# EAGLE design V0p2_Main_PCB2 (EAGLE 6.4)
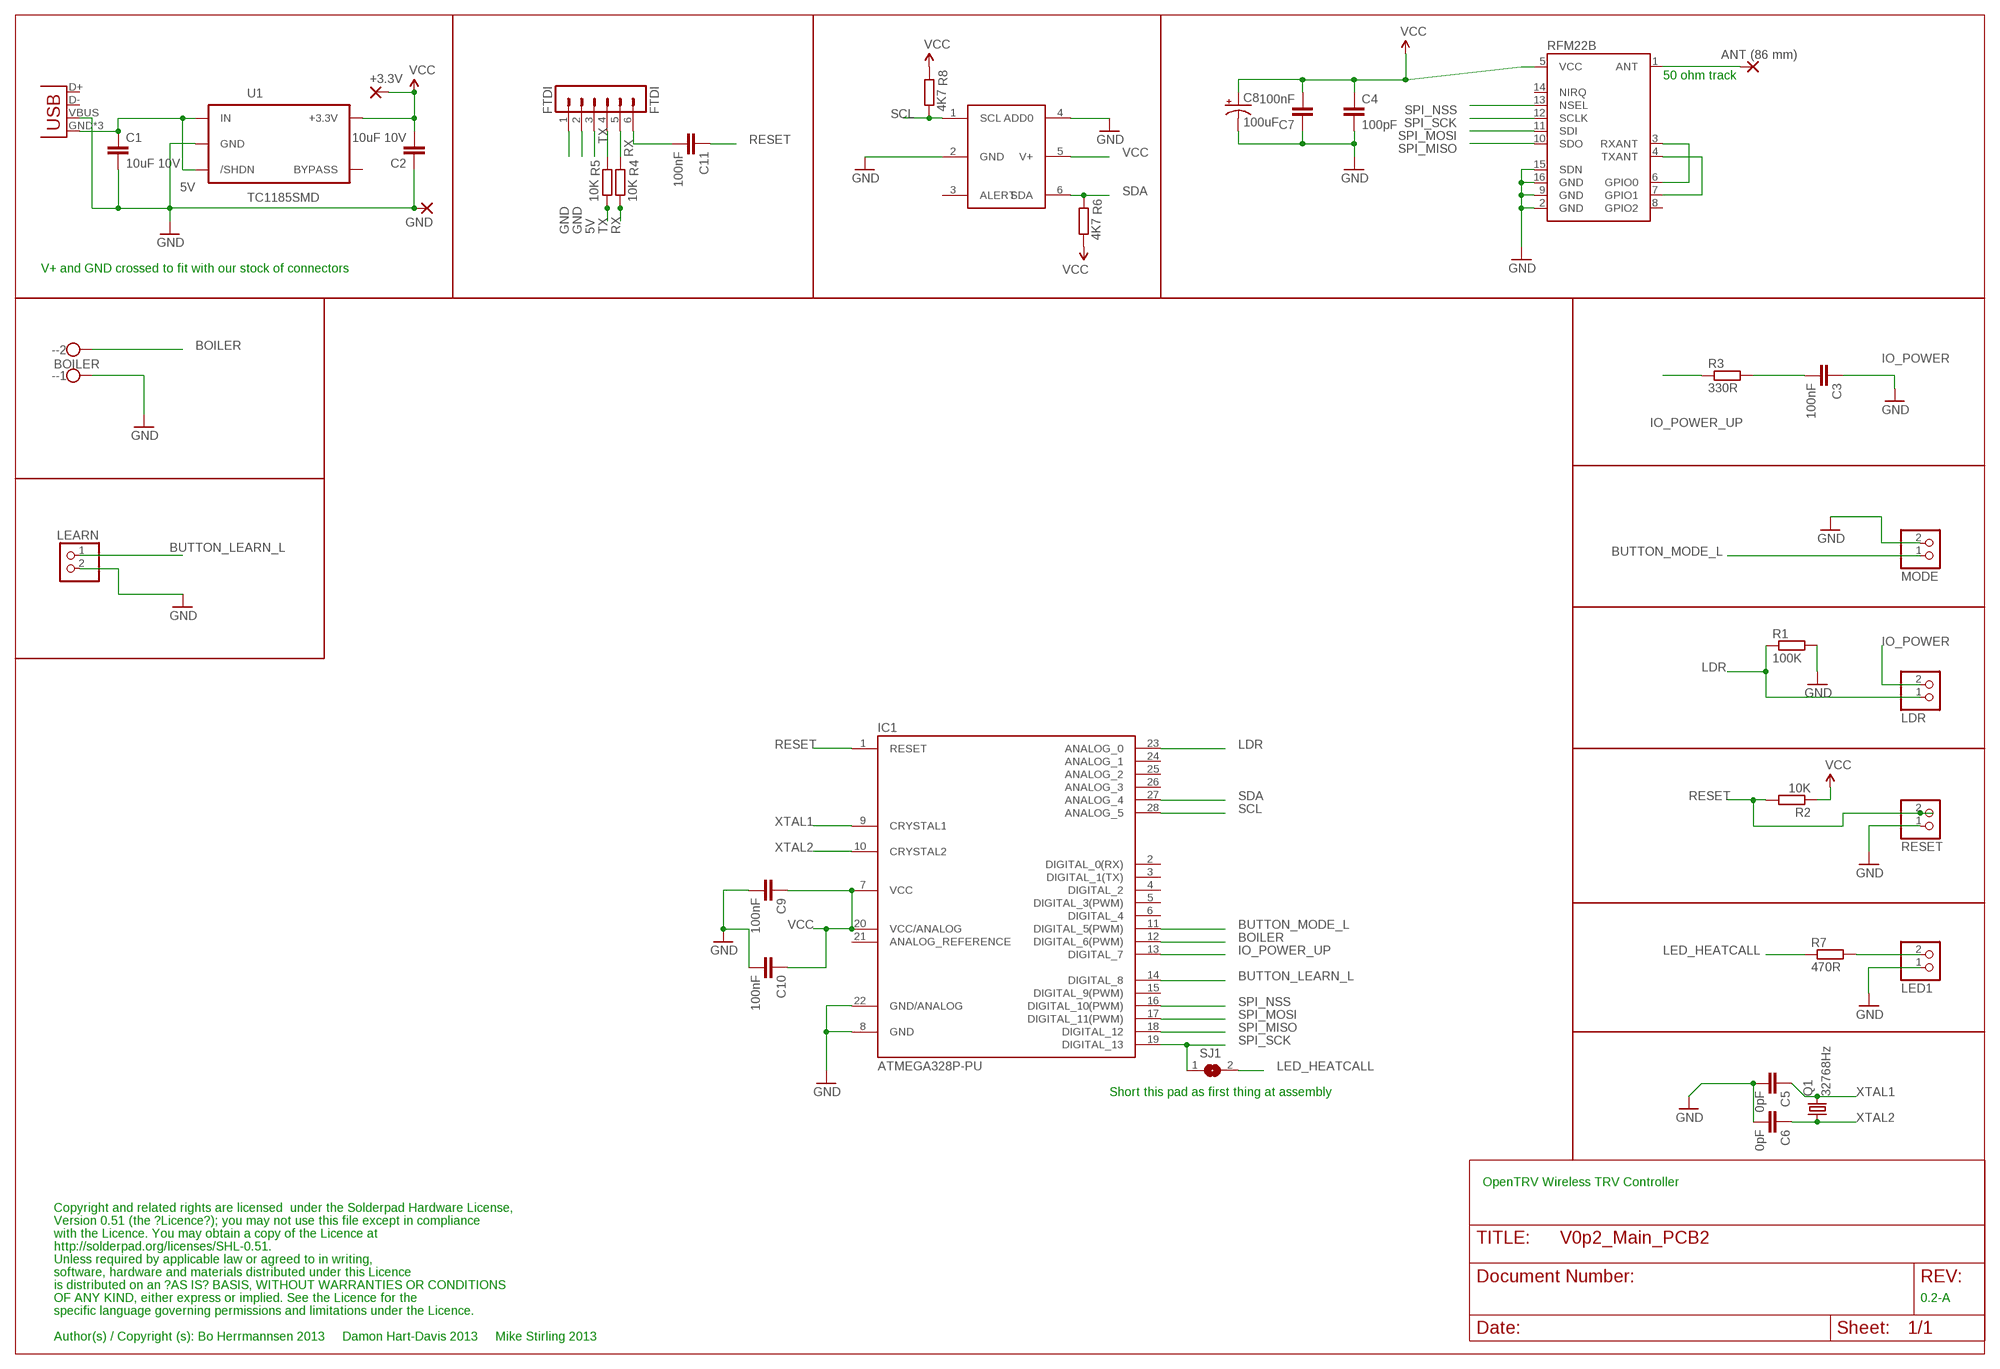
[diagram p0: schematic, sheet 1]

## Parts
5V  USB-MICROB  [USB-MICROB]
+3.3V  2,15/1,0  [2,15/1,0]
-  BOILER  W237-102  [W237-102]
ANT  ANT (86 mm)  2,15/1,0  [2,15/1,0]
C1  10uF 10V  CAP0603-CAP  [0603-CAP]
C2  10uF 10V  CAP0603-CAP  [0603-CAP]
C3  100nF  CAP0603-CAP  [0603-CAP]
C4  100pF  CAP0603-CAP  [0603-CAP]
C5  0pF  CAP0603-CAP  [0603-CAP]
C6  0pF  CAP0603-CAP  [0603-CAP]
C7  100nF  CAP0603-CAP  [0603-CAP]
C8  100uF  CAP_POL1206  [EIA3216]
C9  100nF  CAP0603-CAP  [0603-CAP]
C10  100nF  CAP0603-CAP  [0603-CAP]
C11  100nF  CAP0603-CAP  [0603-CAP]
FTDI  FTDI  MA06-1  [MA06-1]
GND  2,15/1,0  [2,15/1,0]
IC1  ATMEGA328P-PU  ATMEGA168-PU  [DIL28-3]
LDR  PINHD-1X2  [1X02]
LEARN  PINHD-1X2  [1X02]
LED1  PINHD-1X2  [1X02]
MODE  PINHD-1X2  [1X02]
Q1  32768Hz  CRYSTALHC49S  [HC49/S]
R1  100K  R-EU_R0603  [R0603]
R2  10K  R-EU_R0603  [R0603]
R3  330R  R-EU_R0603  [R0603]
R4  10K  R-EU_R0603  [R0603]
R5  10K  R-EU_R0603  [R0603]
R6  4K7  R-EU_R0603  [R0603]
R7  470R  R-EU_R0603  [R0603]
R8  4K7  R-EU_R0603  [R0603]
RESET  PINHD-1X2  [1X02]
RFM22B  RFM22SMD  [RFM22-XXX-S2]
SJ1  SJ  [SJ]
TMP112  TMP112  [TMP112]
U1  TC1185SMD  [TC1185]

## Nets
5V: 5V.GND 5V.MT1(GND) 5V.MT2(GND) C1.1 FTDI.3(VCC) U1.1(IN) U1.3(/SHDN)
BOILER: -.2 IC1.12(DIGITAL_6(PWM))
BUTTON_LEARN_L: IC1.14(DIGITAL_8) LEARN.1
BUTTON_MODE_L: IC1.11(DIGITAL_5(PWM)) MODE.1
GND: 5V.VBUS -.1 C1.2 C2.1 C4.2 C5.2 C6.2 C7.1 C8.C(-) C9.2 C10.2 FTDI.1(GND) FTDI.2(CTS) GND.1(P) IC1.8(GND) IC1.22(GND/ANALOG) LEARN.2 LED1.1 MODE.2 R1.2 RESET.1 RFM22B.2(GND) RFM22B.9(GND) RFM22B.15(SDN) RFM22B.16(GND) TMP112.2(GND) TMP112.4(ADD0) U1.2(GND)
IO_POWER: C3.1 LDR.2 ; supply symbol labelled GND
IO_POWER_UP: IC1.13(DIGITAL_7) R3.1
LDR: IC1.23(ANALOG_0) LDR.1 R1.1
LED_HEATCALL: R7.1 SJ1.2
LEDEXT: LED1.2 R7.2
N$1: C11.2 FTDI.6(RTS)
N$2: C3.2 R3.2
N$20: RFM22B.3(RXANT) RFM22B.6(GPIO0)
N$21: RFM22B.4(TXANT) RFM22B.7(GPIO1)
N$26: ANT.1(P) RFM22B.1(ANT)
RESET: C11.1 IC1.1(RESET) R2.2 RESET.2
RX: FTDI.5(RX) R4.1 R4.2
SCL: IC1.28(ANALOG_5) R8.1 TMP112.1(SCL)
SDA: IC1.27(ANALOG_4) R6.2 TMP112.6(SDA)
SPI_MISO: IC1.18(DIGITAL_12) RFM22B.10(SDO)
SPI_MOSI: IC1.17(DIGITAL_11(PWM)) RFM22B.11(SDI)
SPI_NSS: IC1.16(DIGITAL_10(PWM)) RFM22B.13(NSEL)
SPI_SCK: IC1.19(DIGITAL_13) RFM22B.12(SCLK) SJ1.1
TX: FTDI.4(TX) R5.1 R5.2
VCC: +3.3V.1(P) C2.2 C4.1 C7.2 C8.A(+) C9.1 C10.1 IC1.7(VCC) IC1.20(VCC/ANALOG) R2.1 R6.1 R8.2 RFM22B.5(VCC) TMP112.5(V+) U1.5(+3.3V)
XTAL1: C5.1 IC1.9(CRYSTAL1) Q1.2
XTAL2: C6.1 IC1.10(CRYSTAL2) Q1.1
Unconnected: 5V.D+ 5V.D- IC1.2(DIGITAL_0(RX)) IC1.3(DIGITAL_1(TX)) IC1.4(DIGITAL_2) IC1.5(DIGITAL_3(PWM)) IC1.6(DIGITAL_4) IC1.15(DIGITAL_9(PWM)) IC1.21(ANALOG_REFERENCE) IC1.24(ANALOG_1) IC1.25(ANALOG_2) IC1.26(ANALOG_3) RFM22B.8(GPIO2) RFM22B.14(NIRQ) TMP112.3(ALERT) U1.4(BYPASS)

## Notes on the sheet
- 50 ohm track
- V+ and GND crossed to fit with our stock of connectors
- Short this pad as first thing at assembly
- OpenTRV Wireless TRV Controller
- Copyright and related rights are licensed  under the Solderpad Hardware License,
- Version 0.51 (the ?Licence?); you may not use this file except in compliance
- with the Licence. You may obtain a copy of the Licence at
- http://solderpad.org/licenses/SHL-0.51.
- Unless required by applicable law or agreed to in writing,
- software, hardware and materials distributed under this Licence
- is distributed on an ?AS IS? BASIS, WITHOUT WARRANTIES OR CONDITIONS
- OF ANY KIND, either express or implied. See the Licence for the | 0.2-A
- specific language governing permissions and limitations under the Licence.
- Author(s) / Copyright (s): Bo Herrmannsen 2013     Damon Hart-Davis 2013     Mike Stirling 2013

## Library data of the parts
5V = SparkFun-Connectors:USB: USB Connectors USB-B-PTH is fully proven SKU : PRT-00139 USB-miniB is fully proven SKU : PRT-00587 USB-A-PCB is untested. USB-A-H is throughly reviewed, but untested. Spark Fun Electronics SKU : PRT-00437 USB-B-SMT is throughly reviewed, but untested. Needs silkscreen touching up. USB-A-S has not been used/tested USB-MB-H has not been used/tested
+3.3V ANT GND = wirepad:2,15/1,0: THROUGH-HOLE PAD
- = con-wago-500:W237-102: WAGO SCREW CLAMP; MPN: 237-102; OC_FARNELL: unknown; OC_NEWARK: 70K9898
C1-C7 C9-C11 = SparkFun-Passives:CAP: Capacitor Standard 0603 ceramic capacitor, and 0.1" leaded capacitor.
C8 = SparkFun-Passives:CAP_POL: Capacitor Polarized These are standard SMD and PTH capacitors. Normally 10uF, 47uF, and 100uF in electrolytic and tantalum varieties. Always verify the external diameter of the through hole cap, it varies with capacity, voltage, and manufacturer. The EIA devices should be standard.
FTDI = FTDI:MA06-1: PIN HEADER; OC_FARNELL: unknown; OC_NEWARK: unknown
IC1 = Arduino-AVR:ATMEGA168-PU
LDR LEARN LED1 MODE RESET = pinhead:PINHD-1X2: PIN HEADER
Q1 = crystal:CRYSTAL: CRYSTAL; OC_FARNELL: 1667008; OC_NEWARK: unknown
R1-R8 = resistor:R-EU_: RESISTOR, European symbol
RFM22B = SparkFun-RF:RFM22: The RFM22 is a low-power, low cost radio that is capable of operating in the 434MHz and 900MHz open bands. It's frequency is software defined and there are some very good libraries written for it.
SJ1 = jumper:SJ: SMD solder JUMPER
TMP112 = TMP112:TMP112
U1 = 3.3VREG:TC1185

## Board
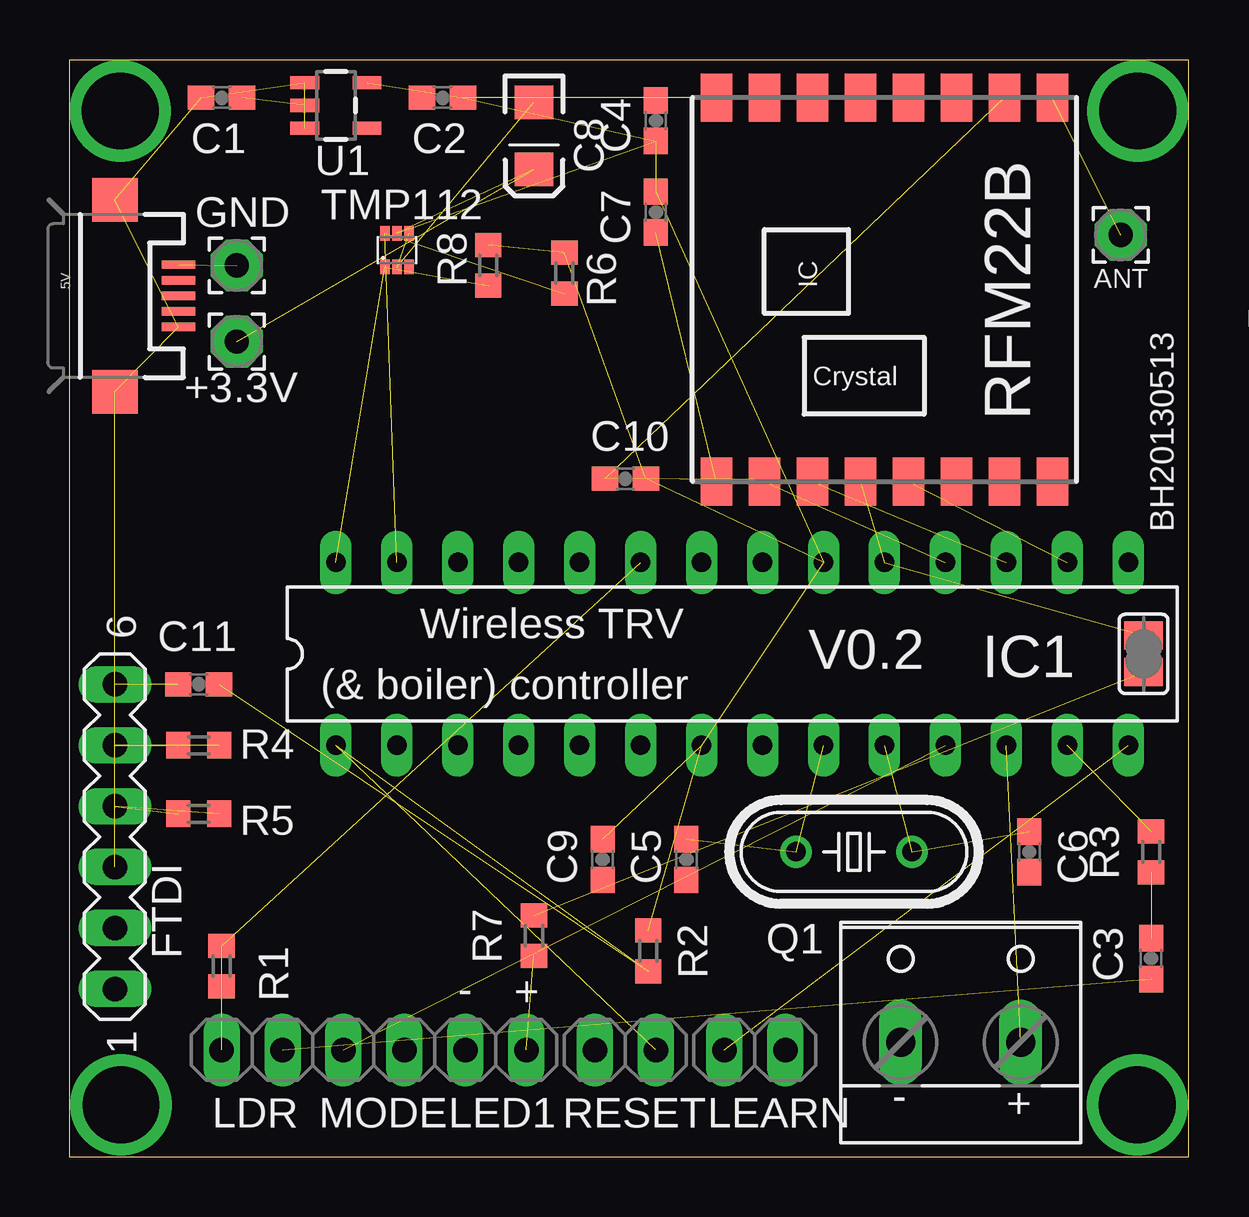
[diagram p1: board, top side]
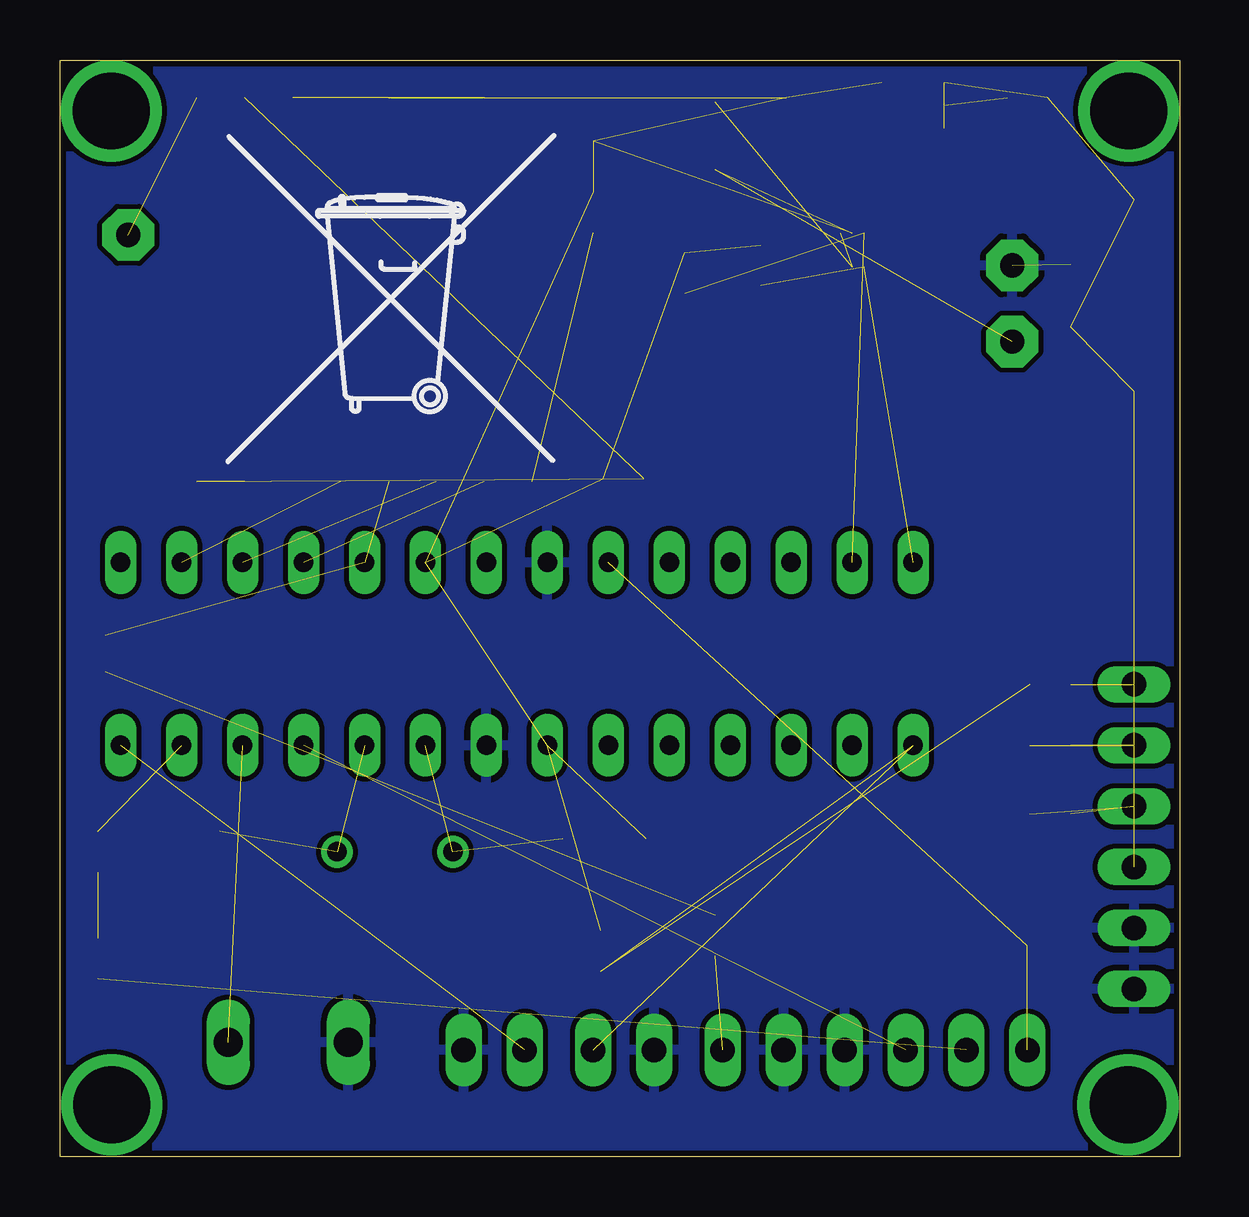
[diagram p2: board, bottom side, seen from below]

Size 46.66 x 45.71 mm. Coordinates in mm from the lower left corner, seen from the top.
Outline: 0,0 46.66,0 46.66,45.71 0,45.71 0,0
Copper layers (1*16): Top 0.035mm / dielectric 1.5mm / Bottom 0.035mm
Design rules "PMServicesStd": minimum track width 8mil, minimum drill 12mil, track to track 8mil, track to pad 8mil, pad to pad 8mil, via to via 8mil, smd to smd 0mil, copper to edge 10mil, drill to drill 10mil, minimum pad ring 10mil, minimum via ring 6mil, stop-mask expansion 2mil, vias tented up to drill 100mil, thermal gap 10mil

### Footprints (pad centres in the part's own frame; a part is rotated, then mirrored left to right if it is on the bottom)
USB-MICROB = smd 0.35 x 1.4: D+ 0,2.65; D- -0.65,2.65; GND 1.3,2.65; ID 0.65,2.65; VBUS -1.3,2.65 | smd 1.8 x 1.9: MT1 -4,0; MT2 4,0
2,15/1,0 = drill 1.016 pad 2.159 octagon: 1 0,0
W237-102 = drill 1.194 long: 1 -2.5,-1.27; 2 2.5,-1.27
0603-CAP = smd 1.1 x 1: 1 -0.85,0; 2 0.85,0
EIA3216 = smd 1.4 x 1.6: A 1.4,0; C -1.4,0
MA06-1 = drill 1.016 long: 1 -6.35,0; 2 -3.81,0; 3 -1.27,0; 4 1.27,0; 5 3.81,0; 6 6.35,0
DIL28-3 = drill 0.813 long: 1 -16.51,-3.81; 2 -13.97,-3.81; 3 -11.43,-3.81; 4 -8.89,-3.81; 5 -6.35,-3.81; 6 -3.81,-3.81; 7 -1.27,-3.81; 8 1.27,-3.81; 9 3.81,-3.81; 10 6.35,-3.81; 11 8.89,-3.81; 12 11.43,-3.81; 13 13.97,-3.81; 14 16.51,-3.81; 15 16.51,3.81; 16 13.97,3.81; 17 11.43,3.81; 18 8.89,3.81; 19 6.35,3.81; 20 3.81,3.81; 21 1.27,3.81; 22 -1.27,3.81; 23 -3.81,3.81; 24 -6.35,3.81; 25 -8.89,3.81; 26 -11.43,3.81; 27 -13.97,3.81; 28 -16.51,3.81
1X02 = drill 1.016 long: 1 -1.27,0; 2 1.27,0
HC49/S = drill 0.813: 1 -2.413,0; 2 2.413,0
R0603 = smd 1 x 1.1: 1 -0.85,0; 2 0.85,0
RFM22-XXX-S2 = smd 2 x 1.3: 1 -8,7; 2 -8,5; 3 -8,3; 4 -8,1; 5 -8,-1; 6 -8,-3; 7 -8,-5; 8 -8,-7; 9 8,-7; 10 8,-5; 11 8,-3; 12 8,-1; 13 8,1; 14 8,3; 15 8,5; 16 8,7
SJ = smd 1.168 x 1.6: 1 -0.762,0; 2 0.762,0
TMP112 = smd 0.4 x 0.6: 1 -0.5,-0.7; 2 0,-0.7; 3 0.5,-0.7; 4 0.5,0.7; 5 0,0.7; 6 -0.5,0.7
TC1185 = smd 0.55 x 1.2: 1 -0.95,-1.3; 2 0,-1.3; 3 0.95,-1.3; 4 0.95,1.3; 5 -0.95,1.3

### Placement (x,y rotation side)
5V  1.91,35.88 270 top
+3.3V  6.99,33.97 0 top
-  37.15,6.03 0 top
ANT  43.81,38.42 180 top
C1  6.35,44.13 0 top
C2  15.56,44.13 0 top
C3  45.09,8.26 90 top
C4  24.45,43.18 90 top
C5  25.72,12.38 270 top
C6  40.01,12.7 270 top
C7  24.45,39.37 90 top
C8  19.37,42.55 270 top
C9  22.23,12.38 270 top
C10  23.18,28.26 180 top
C11  5.4,19.68 180 top
FTDI  1.91,13.34 90 top
GND  6.99,37.15 0 top
IC1  27.62,20.95 0 top
LDR  7.62,4.45 0 top
LEARN  28.57,4.45 0 top
LED1  17.78,4.45 0 top
MODE  12.7,4.45 0 top
Q1  32.7,12.7 180 top
R1  6.35,7.94 270 top
R2  24.13,8.57 270 top
R3  45.09,12.7 270 top
R4  5.4,17.14 180 top
R5  5.4,14.29 180 top
R6  20.64,36.83 270 top
R7  19.37,9.21 270 top
R8  17.46,37.15 90 top
RESET  23.18,4.45 0 top
RFM22B  33.97,36.14 270 top
SJ1  44.77,20.95 270 top
TMP112  13.65,37.78 0 top
U1  11.11,43.81 270 top
U$2  [TONNE]  33.02,33.02 0 bottom
U$3  [OSHW_6X200_NOTEXT]  49.21,32.7 0 top

### Tracks (layer width: path | path; a pad name or v marks a point on that pad's centre or on a via)
5V  (6 unrouted)
BOILER  (1 unrouted)
BUTTON_LEARN_L  (1 unrouted)
BUTTON_MODE_L  (1 unrouted)
GND  (8 unrouted)
  pour Bottom: 0,45.72 0,0 46.99,0 46.35,45.72
IO_POWER  (1 unrouted)
IO_POWER_UP  (1 unrouted)
LDR  (2 unrouted)
LED_HEATCALL  (1 unrouted)
LEDEXT  (1 unrouted)
N$1  (1 unrouted)
N$2  (1 unrouted)
N$4  (via drill 3.2)
  other vias: 2.13,43.59
N$12  (via drill 3.2)
  other vias: 44.5,2.16
N$19  (via drill 3.2)
  other vias: 44.53,43.59
N$20  (1 unrouted)
N$21  (1 unrouted)
N$22  (via drill 3.2)
  other vias: 2.16,2.16
N$26  (1 unrouted)
RESET  (3 unrouted)
RX  (2 unrouted)
SCL  (2 unrouted)
SDA  (2 unrouted)
SPI_MISO  (1 unrouted)
SPI_MOSI  (1 unrouted)
SPI_NSS  (1 unrouted)
SPI_SCK  (2 unrouted)
TX  (2 unrouted)
VCC  (14 unrouted)
XTAL1  (2 unrouted)
XTAL2  (2 unrouted)

### Text on the board
tNames: BH20130513 | Wireless TRV | V0.2 | (& boiler) controller | - | + | - | +